# Altium schematic sheet ARAStronaut.SchDoc
size C
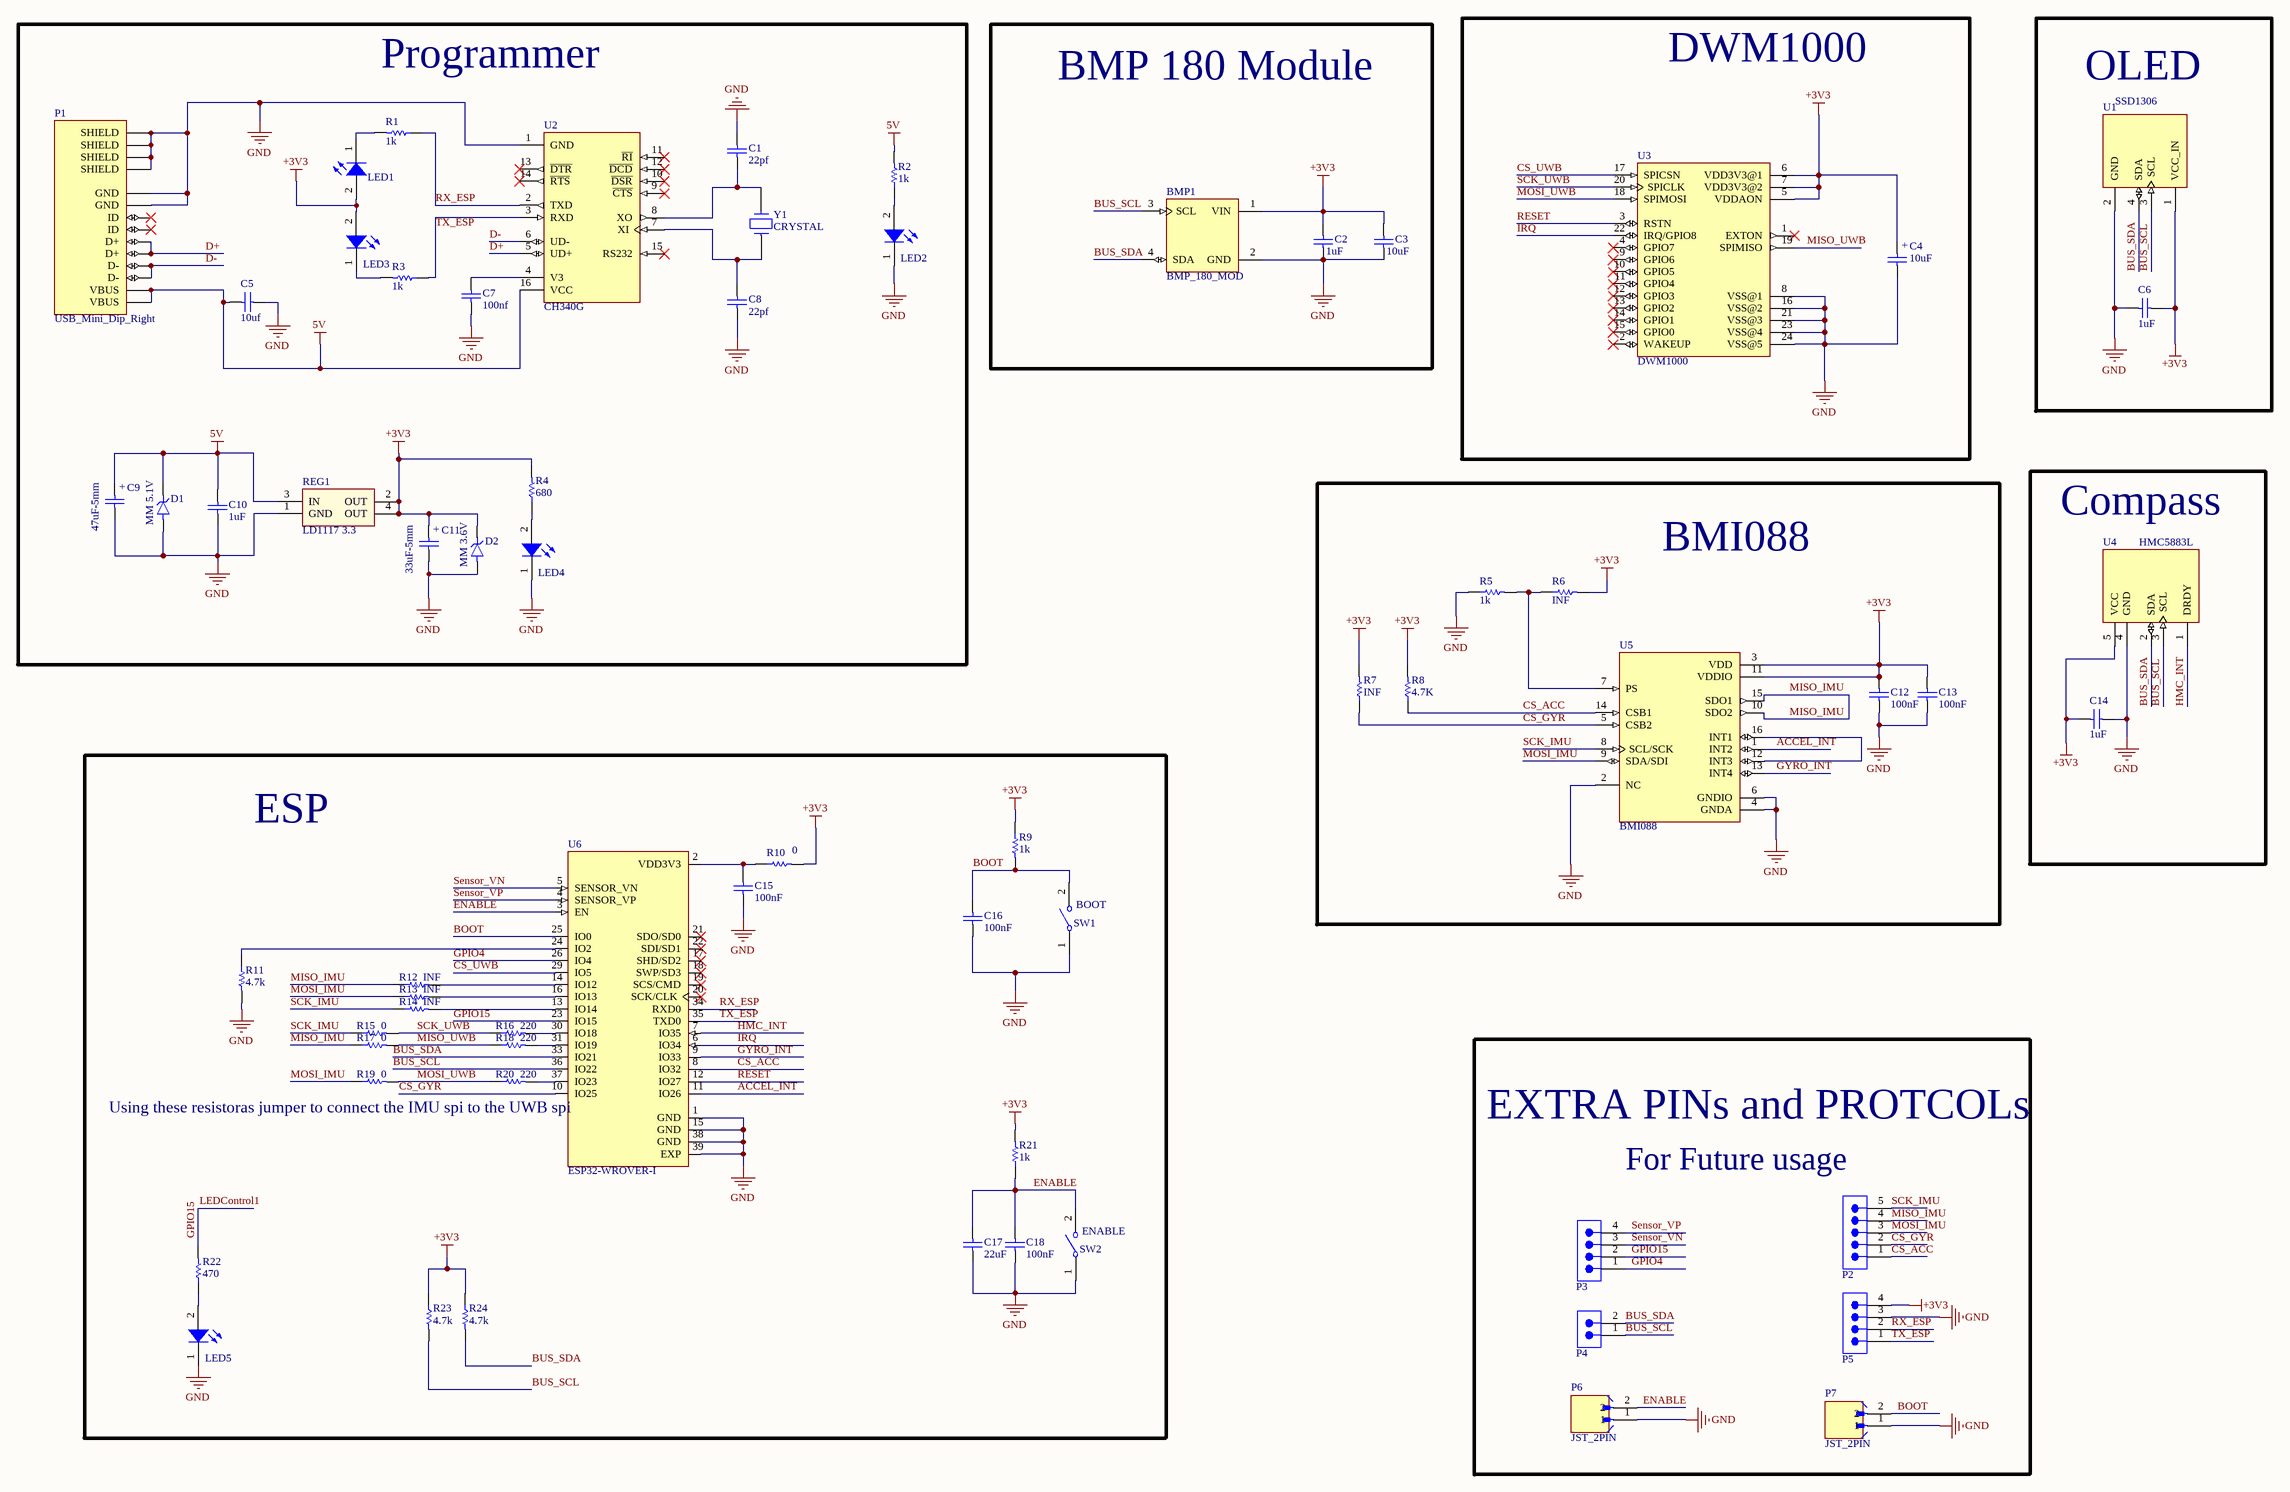
[diagram p0: ARAStronaut.SchDoc]

## Parts
BMP1  BMP_180_MOD  [BMP180]
C1  22pf  [SMD 805 CAP]
C2  1uF  [SMD 805 CAP]
C3  10uF  [SMD 805 CAP]
C4  10uF  [MY_CAP_SMD-B]
C5  10uf  [SMD 805 CAP]
C6  1uF  [SMD 805 CAP]
C7  100nf  [SMD 805 CAP]
C8  22pf  [SMD 805 CAP]
C9  47uF-5mm  [MY_CAP_POL 5MM]
C10  1uF  [SMD 805 CAP]
C11  33uF-5mm  [MY_CAP_POL 5MM]
C12  100nF  [SMD 805 CAP]
C13  100nF  [SMD 805 CAP]
C14  1uF  [SMD 805 CAP]
C15  100nF  [SMD 805 CAP]
C16  100nF  [SMD 805 CAP]
C17  22uF  [SMD 805 CAP]
C18  100nF  [SMD 805 CAP]
D1  MM 5.1V  [MiniMelf]
D2  MM 3.6V  [MiniMelf]
LED1  LED_SMD_0805  [LED_0805]  (value not drawn)
LED2  LED_SMD_0805  [LED_0805]  (value not drawn)
LED3  LED_SMD_0805  [LED_0805]  (value not drawn)
LED4  LED_SMD_0805  [LED_0805]  (value not drawn)
LED5  LED_SMD_0805  [LED_0805]  (value not drawn)
P1  USB_Mini_Dip_Right  [USB_MINI_Right]
P2  61300511121  [61300511121]  (value not drawn)
P3  61300411121  [61300411121]  (value not drawn)
P4  61300211121  [61300211121]  (value not drawn)
P5  61300411121  [61300411121]  (value not drawn)
P6  JST_2PIN  [JST_2PIN]
P7  JST_2PIN  [JST_2PIN]
R1  1k  [SMD 805]
R2  1k  [SMD 805]
R3  1k  [SMD 805]
R4  680  [SMD 805]
R5  1k  [SMD 805]
R6  INF  [SMD 805]
R7  INF  [SMD 805]
R8  4.7K  [SMD 805]
R9  1k  [SMD 805]
R10  0  [SMD 805]
R11  4.7k  [SMD 805]
R12  INF  [SMD 805]
R13  INF  [SMD 805]
R14  INF  [SMD 805]
R15  0  [SMD 805]
R16  220  [SMD 805]
R17  0  [SMD 805]
R18  220  [SMD 805]
R19  0  [SMD 805]
R20  220  [SMD 805]
R21  1k  [SMD 805]
R22  470  [SMD 805]
R23  4.7k  [SMD 805]
R24  4.7k  [SMD 805]
REG1  LD1117 3.3  [MY_LD1117-3.3]
SW1  BOOT  [WS-TASV_L6W3.5H4.3_4341x10438x6]
SW2  ENABLE  [WS-TASV_L6W3.5H4.3_4341x10438x6]
U1  SSD1306  [SSD1306]
U2  CH340G  [CH340G]
U3  DWM1000  [DWM1000]
U4  HMC5883L  [HMC5883L-GY271]
U5  BMI088  [BMI088]
U6  ESP32-WROVER-I  [ESP32-WROVER-I]
Y1  CRYSTAL  [My_Crystal]

## Blocks framed on the sheet
Programmer: C1 C5 C7-C11 D1 D2 LED1-LED4 P1 R1-R4 REG1 U2 Y1
BMP 180 Module: BMP1 C2 C3
DWM1000: C4 U3
OLED: C6 U1
BMI088: C12 C13 R5-R8 U5
Compass: C14 U4
ESP: C15-C18 LED5 R9-R24 SW1 SW2 U6
EXTRA PINs and PROTCOLs: P2-P7

## Nets
5V: C5.1 C9.+ C10.2 D1.2 P1.1(VBUS) P1.6(VBUS) R2.2 REG1.3(IN) U2.16(VCC)
+3V3: BMP1.1(VIN) C2.1 C3.1 C4.+ C6.2 C11.+ C12.2 C13.2 C14.1 D2.2 LED1.2(A) LED3.2(A) P5.4 R4.2 R6.2 R7.2 R8.2 R9.1 R10.2 R21.2 R23.1 R24.1 REG1.2(OUT) REG1.4(OUT) U1.1(VCC_IN) U3.5(VDDAON) U3.6(VDD3V3@1) U3.7(VDD3V3@2) U4.5(VCC) U5.3(VDD) U5.11(VDDIO)
GND: BMP1.2(GND) C1.2 C2.2 C3.2 C4.- C5.2 C6.1 C7.1 C8.1 C9.- C10.1 C11.- C12.1 C13.1 C14.2 C15.1 C16.1 C17.1 C18.1 D1.1 D2.1 LED2.1(K) LED4.1(K) LED5.1(K) P1.5(GND) P1.10(GND) P1.11(SHIELD) P1.12(SHIELD) P1.S1(SHIELD) P1.S2(SHIELD) P5.3 P6.1 P7.1 R5.1 R11.2 REG1.1(GND) SW1.1 SW2.1 U1.2(GND) U2.1(GND) U3.8(VSS@1) U3.16(VSS@2) U3.21(VSS@3) U3.23(VSS@4) U3.24(VSS@5) U4.4(GND) U5.2(NC) U5.4(GNDA) U5.6(GNDIO) U6.1(GND) U6.15(GND) U6.38(GND) U6.39(EXP)
ACCEL_INT: U5.1(INT2) U6.11(IO26)
BOOT: C16.2 P7.2 R9.2 SW1.2 U6.25(IO0)
BUS_SCL: BMP1.3(SCL) P4.1 R23.2 U1.3(SCL) U4.3(SCL) U6.36(IO22)
BUS_SDA: BMP1.4(SDA) P4.2 R24.2 U1.4(SDA) U4.2(SDA) U6.33(IO21)
CS_ACC: P2.1 R8.1 U5.14(CSB1) U6.8(IO32)
CS_GYR: P2.2 R7.1 U5.5(CSB2) U6.10(IO25)
CS_UWB: U3.17(SPICSN) U6.29(IO5)
D+: P1.3(D+) P1.8(D+) U2.5(UD+)
D-: P1.2(D-) P1.7(D-) U2.6(UD-)
ENABLE: C17.2 C18.2 P6.2 R21.1 SW2.2 U6.3(EN)
GPIO4: P3.1 U6.26(IO4)
GPIO15: P3.2 R22.2 U6.23(IO15)  [also labelled LEDControl1]
GYRO_INT: U5.13(INT4) U6.9(IO33)
HMC_INT: U4.1(DRDY) U6.7(IO35)
IRQ: U3.22(IRQ/GPIO8) U6.6(IO34)
MISO_IMU: P2.4 R12.1 R17.1 U5.10(SDO2) U5.15(SDO1)
MISO_UWB: R17.2 R18.1 U3.19(SPIMISO)
MOSI_IMU: P2.3 R13.1 R19.1 U5.9(SDA/SDI)
MOSI_UWB: R19.2 R20.1 U3.18(SPIMOSI)
RESET: U3.3(RSTN) U6.12(IO27)
RX_ESP: P5.2 R1.1 U2.2(TXD) U6.34(RXD0)
SCK_IMU: P2.5 R14.1 R15.1 U5.8(SCL/SCK)
SCK_UWB: R15.2 R16.1 U3.20(SPICLK)
Sensor_VN: P3.3 U6.5(SENSOR_VN)
Sensor_VP: P3.4 U6.4(SENSOR_VP)
TX_ESP: P5.1 R3.1 U2.3(RXD) U6.35(TXD0)
NetC1_1: C1.1 U2.8(XO) Y1.2
NetC7_2: C7.2 U2.4(V3)
NetC8_2: C8.2 U2.7(XI) Y1.1
NetC15_2: C15.2 R10.1 U6.2(VDD3V3)
NetLED1_1: LED1.1(K) R1.2
NetLED2_2: LED2.2(A) R2.1
NetLED3_1: LED3.1(K) R3.2
NetLED4_2: LED4.2(A) R4.1
NetLED5_2: LED5.2(A) R22.1
NetR5_2: R5.2 R6.1 U5.7(PS)
NetR11_1: R11.1 U6.24(IO2)
NetR12_2: R12.2 U6.14(IO12)
NetR13_2: R13.2 U6.16(IO13)
NetR14_2: R14.2 U6.13(IO14)
NetR16_2: R16.2 U6.30(IO18)
NetR18_2: R18.2 U6.31(IO19)
NetR20_2: R20.2 U6.37(IO23)
NetU5_12: U5.12(INT3) U5.16(INT1)

Not connected (* = marked no-connect by the designer): P1 4(ID)* 9(ID)*; U2 9(~{CTS})* 10(~{DSR})* 11(~{RI})* 12(~{DCD})* 13(~{DTR})* 14(~{RTS})* 15(RS232)*; U3 1(EXTON)* 2(WAKEUP)* 4(GPIO7)* 9(GPIO6)* 10(GPIO5)* 11(GPIO4)* 12(GPIO3)* 13(GPIO2)* 14(GPIO1)* 15(GPIO0)*; U6 17(SHD/SD2)* 18(SWP/SD3)* 19(SCS/CMD)* 20(SCK/CLK)* 21(SDO/SD0)* 22(SDI/SD1)*

## Notes on the sheet
- (near U6) Using these resistoras jumper to connect the IMU spi to the UWB spi
- (near P2) For Future usage

## Library data of the parts
C1 C5 C7 C8 = CAP B: 1uf
C2 C3 C6 C10 C12-C18 = CAP B
C4 = CAP_TANTAL_B: 3.5X2.8MM; Value: 3300u
C9 C11 = Cap Pol_5mm: CAP-3300Uf; Value: 3300u
D1 D2 = MiniMelf_500mW: MP: ZM4736A_L0; Package: None; Availability: Unavailable; Price: None; Value: *
P2 = 61300511121: WR-PHD Pin Header, THT, Vertical, pitch 2.54mm, 1 Row, 5P; Manufacturer: Wurth Elektronik; Contact Resistance: 20mΩ; Rated Current: 3A; Working Voltage: 250V; Withstanding Voltage: 500V; ComponentLink1Description: Website Link; ComponentLink1URL: https://www.we-online.com/redexpert/article/61300511121?ad; ComponentLink2Description: Datasheet Link; ComponentLink2URL: https://www.we-online.com/redexpert/spec/61300511121?ad; Manufacturer Part Number: 61300511121; Category: Board-to-Board Connectors; Match Code: WR-PHD; Mount: Through Hole; Operating Temperature Max: 105°C; Operating Temperature Min: -40°C; Packaging: Bag; Gender: Pin Header; Number of Pins: 5; Number of Rows: 1; Orientation: Vertical; Pitch: 2.54mm
P3 P5 = 61300411121: WR-PHD Pin Header, THT, Vertical, pitch 2.54mm, 1 Row, 4P; Manufacturer: Wurth Elektronik; Contact Resistance: 20mΩ; Rated Current: 3A; Working Voltage: 250V; Withstanding Voltage: 500V; ComponentLink1Description: Website Link; ComponentLink1URL: https://www.we-online.com/redexpert/article/61300411121?ad; ComponentLink2Description: Datasheet Link; ComponentLink2URL: https://www.we-online.com/redexpert/spec/61300411121?ad; Manufacturer Part Number: 61300411121; Category: Board-to-Board Connectors; Match Code: WR-PHD; Mount: Through Hole; Operating Temperature Max: 105°C; Operating Temperature Min: -40°C; Packaging: Bag; Gender: Pin Header; Number of Pins: 4; Number of Rows: 1; Orientation: Vertical; Pitch: 2.54mm
P4 = 61300211121: WR-PHD Pin Header, THT, Vertical, pitch 2.54mm, 1 Row, 2P; Manufacturer: Wurth Elektronik; Contact Resistance: 20mΩ; Rated Current: 3A; Working Voltage: 250V; Withstanding Voltage: 500V; ComponentLink1Description: Website Link; ComponentLink1URL: https://www.we-online.com/redexpert/article/61300211121?ad; ComponentLink2Description: Datasheet Link; ComponentLink2URL: https://www.we-online.com/redexpert/spec/61300211121?ad; Manufacturer Part Number: 61300211121; Category: Board-to-Board Connectors; Match Code: WR-PHD; Mount: Through Hole; Operating Temperature Max: 105°C; Operating Temperature Min: -40°C; Packaging: Bag; Gender: Pin Header; Number of Pins: 2; Number of Rows: 1; Orientation: Vertical; Pitch: 2.54mm
R1-R24 = Resistor
SW1 SW2 = 434111043826: WS-TASV SMT Tact Switch, L6 x W3.5 x H4.3mm, 260g, SPST-NO, 12V, 50mA; Manufacturer: Wurth Elektronik; Washable: No; Manufacturer Part Number: 434111043826; Category: Tact Switches; Match Code: WS-TASV; ComponentLink1Description: Website Link; ComponentLink1URL: https://www.we-online.com/redexpert/article/434111043826?ad; ComponentLink2Description: Datasheet Link; ComponentLink2URL: https://www.we-online.com/redexpert/spec/434111043826?ad; Mount: Surface Mount; Operating Temperature Max: 85°C; Operating Temperature Min: -40°C; Packaging: Tape and Reel; Length: 6mm; Width: 3.5mm; Height: 4.3mm; Circuit: SPST-NO; Contact Material: Stainless Steel; Contact Plating: Silver; Operation Force: 260g; Rated Current: 50mA; Rated Voltage (DC): 12V; Terminal Material: Copper Alloy; Terminal Plating: Silver